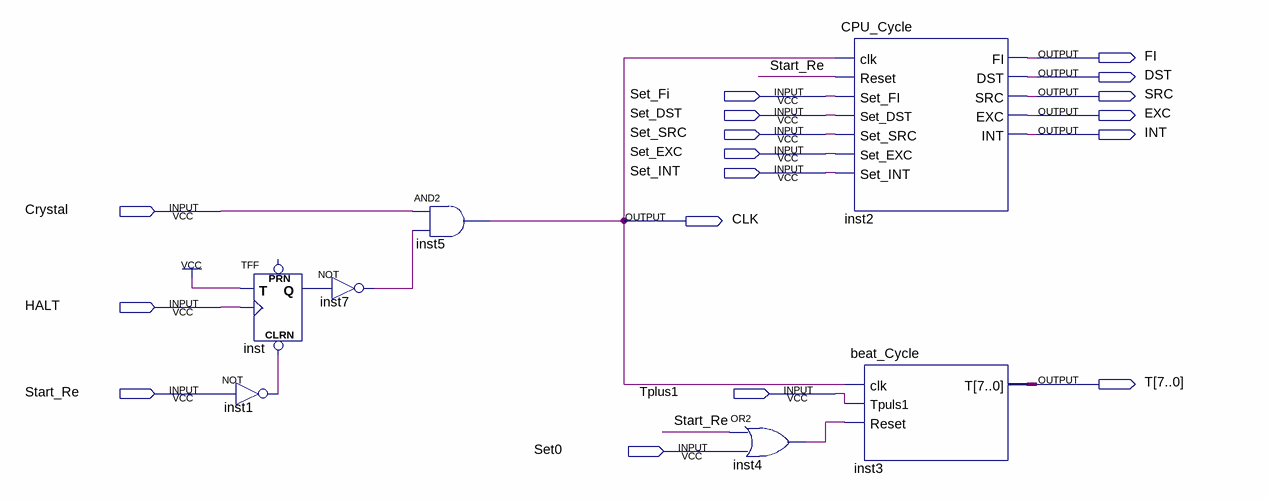
[diagram p0: schematic sheet]
// Quartus schematic Timer.bdf as structural Verilog: 7 symbols, 17 pins
module Timer (
  input  Set_Fi,
  input  Set_DST,
  input  Set_SRC,
  input  Set_EXC,
  input  Set_INT,
  input  Crystal,
  input  HALT,
  input  Start_Re,
  input  Tplus1,
  input  Set0,
  output FI,
  output DST,
  output SRC,
  output EXC,
  output INT,
  output CLK,
  output [7:0] T
);

  wire inst1_out, inst4_out, inst7_out, inst_q;

  not inst1 (inst1_out, Start_Re);
  TFF inst (.CLRN(inst1_out), .T(1'b1), .CLK(HALT), .Q(inst_q));  // open: PRN
  not inst7 (inst7_out, inst_q);
  and inst5 (CLK, Crystal, inst7_out);
  or inst4 (inst4_out, Start_Re, Set0);
  CPU_Cycle inst2 (
    .clk(CLK), .Reset(Start_Re), .Set_FI(Set_Fi), .Set_DST(Set_DST), .Set_SRC(Set_SRC), .Set_EXC(Set_EXC),
    .Set_INT(Set_INT), .FI(FI), .DST(DST), .SRC(SRC), .EXC(EXC), .INT(INT));
  beat_Cycle inst3 (.clk(CLK), .Tpuls1(Tplus1), .Reset(inst4_out), .T(T));
endmodule
